# EAGLE schematic CapMeter-LCD-16F628A (EAGLE 7.6.0)
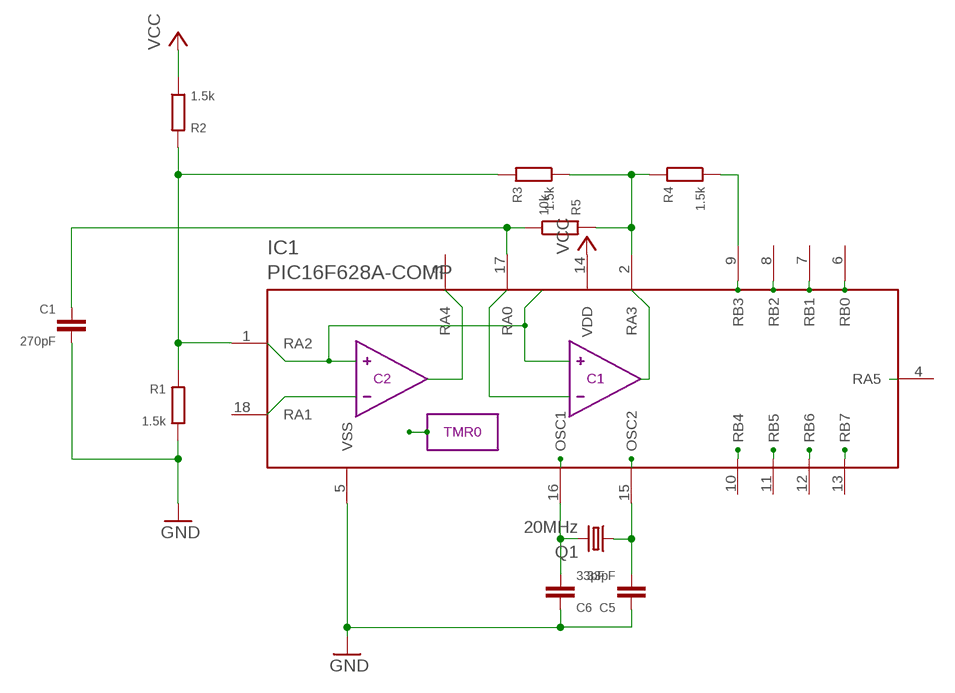
[diagram p0: schematic, sheet 1]

## Parts
C1  270pF  C050-020X036  [C050-020X036]
C5  33pF  C025-020X036  [C025-020X036]
C6  33pF  C025-020X036  [C025-020X036]
IC1  PIC16F628A-COMP  [DIL18-3/V]
Q1  20MHz  CRYSTALHC49  [HC49]
R1  1.5k  R0204/10  [0204/10]
R2  1.5k  R0204/10  [0204/10]
R3  1.5k  R0204/10  [0204/10]
R4  1.5k  R0204/10  [0204/10]
R5  10k  R0204/10  [0204/10]

## Nets
GND: C1.2 C5.1 C6.1 IC1.5(VSS) R1.1
N$1: IC1.2(RA3) R3.1 R4.2 R5.2
N$2: IC1.9(RB3) R4.1
N$3: IC1.1(RA2) R1.2 R2.2 R3.2
N$4: C1.1 IC1.17(RA0) R5.1
OSC1: C6.2 IC1.16(OSC1) Q1.2
OSC2: C5.2 IC1.15(OSC2) Q1.1
VCC: IC1.14(VDD) R2.1
Unconnected: IC1.3(RA4) IC1.4(RA5) IC1.6(RB0) IC1.7(RB1) IC1.8(RB2) IC1.10(RB4) IC1.11(RB5) IC1.12(RB6) IC1.13(RB7) IC1.18(RA1)

## Library data of the parts
C1 C5 C6 = c:C: CAPACITOR, European symbol
IC1 = mcu:PIC16F628A-COMP
Q1 = q:CRYSTAL
R1-R5 = r:R: RESISTOR, European symbol

## Net classes
0 default: width 0.61 mm